# EAGLE schematic FootSwitchBoard1 (EAGLE 6.4)
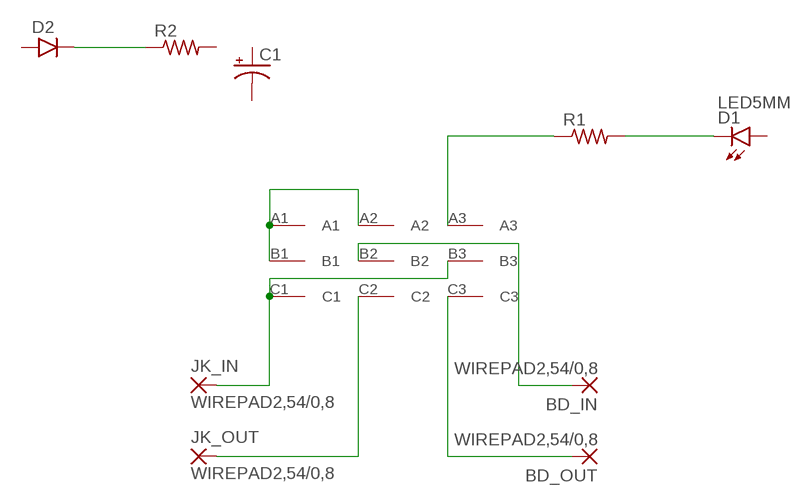
[diagram p0: schematic, sheet 1]

## Parts
BD_IN  WIREPAD2,54/0,8  [2,54/0,8]
BD_OUT  WIREPAD2,54/0,8  [2,54/0,8]
C1  080  [080_035]
D1  LED5MM  [LED5MM]
D2  1N400X.3  [DO41-3]
JK_IN  WIREPAD2,54/0,8  [2,54/0,8]
JK_OUT  WIREPAD2,54/0,8  [2,54/0,8]
R1  6MM.4  [R0207/4]
R2  6MM.4  [R0207/4]
U$1  SF17010F-0302  [ALPHA_SF17010F-0302]

## Nets
N$1: JK_IN.1(P) U$1.B3 U$1.C1
N$2: JK_OUT.1(P) U$1.C2
N$3: BD_OUT.1(P) U$1.C3
N$4: BD_IN.1(P) U$1.B2
N$5: D1.K(C) R1.2
N$6: R1.1 U$1.A3
N$7: U$1.A1 U$1.A2 U$1.B1
N$8: D2.C R2.1
Unconnected: C1.+ C1.- D1.A D2.A R2.2

## Library data of the parts
BD_IN BD_OUT JK_IN JK_OUT = wirepad:WIREPAD: Wire PAD connect wire on PCB
C1 = gm-caps-electro-pol:080: 47 - 470uF Xicon values at Mouser.com 10V: 330, 470uF; 16V: 220, 330uF; 25V: 220uF; 50V: 47, 100uF
D1 = gm-diodes:LED
D2 = gm-diodes:1N400X: Rectifier Diodes often used in power supply to prevent damage from reverse polarization
R1 R2 = gm-resistors:6MM: 6mm Resistors Leads spaced 1-6 holes apart for 0.1" perfboard. Suitable for 1/4 watt resistors.
U$1 = pedal_parts:SF17010F-0302